# EAGLE design CNC-KeyboardBoard (EAGLE 6.3)
CNC Control Panel Keyboard Board 18 keys 16 LEDs
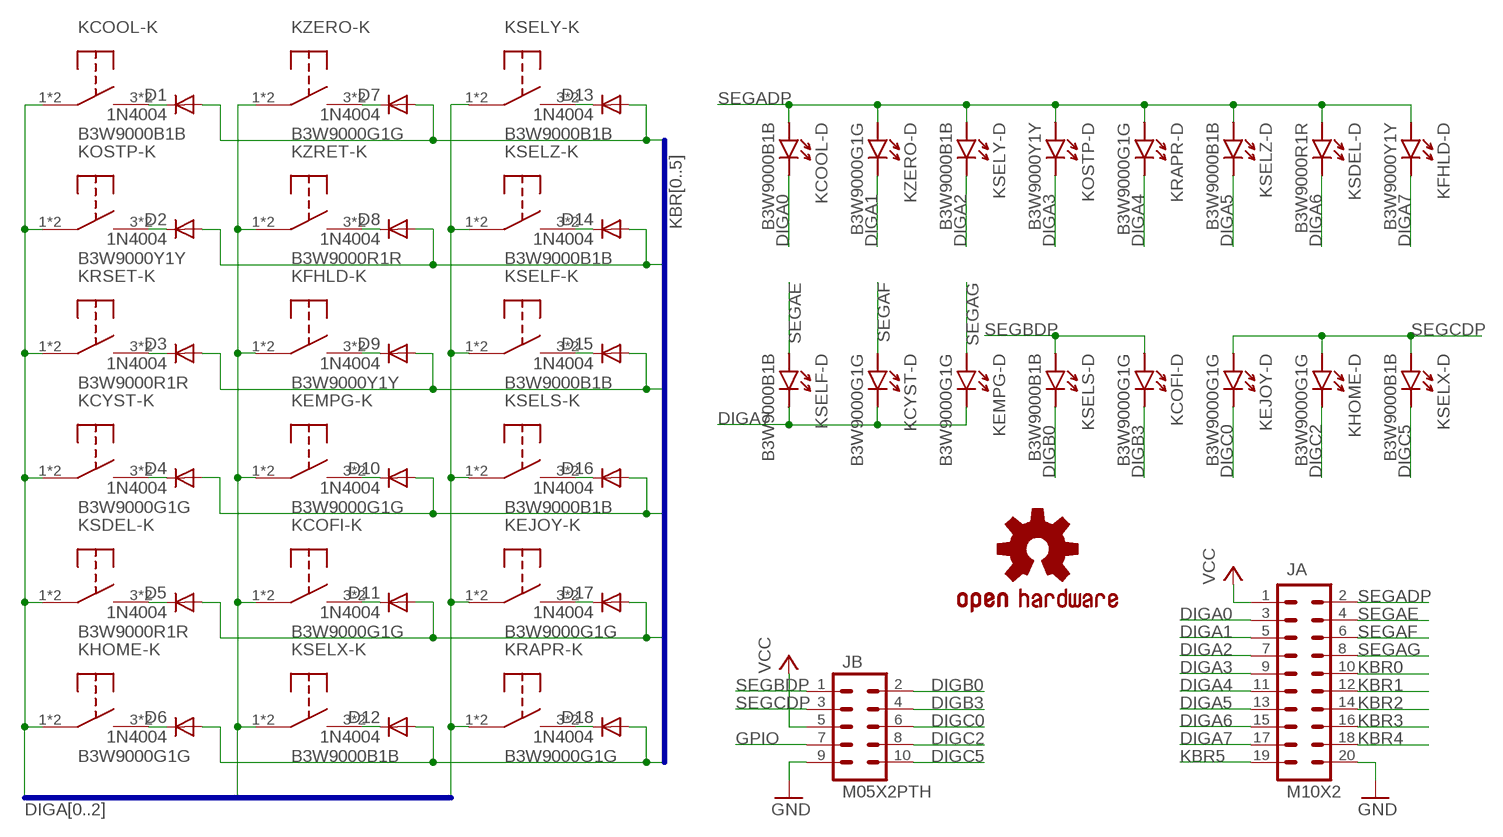
[diagram p0: schematic, sheet 1]

## Parts
D1  1N4004  [DO41-10]
D2  1N4004  [DO41-10]
D3  1N4004  [DO41-10]
D4  1N4004  [DO41-10]
D5  1N4004  [DO41-10]
D6  1N4004  [DO41-10]
D7  1N4004  [DO41-10]
D8  1N4004  [DO41-10]
D9  1N4004  [DO41-10]
D10  1N4004  [DO41-10]
D11  1N4004  [DO41-10]
D12  1N4004  [DO41-10]
D13  1N4004  [DO41-10]
D14  1N4004  [DO41-10]
D15  1N4004  [DO41-10]
D16  1N4004  [DO41-10]
D17  1N4004  [DO41-10]
D18  1N4004  [DO41-10]
JA  M10X2  [2X10]
JB  M05X2PTH  [AVR_ICSP]
KCOFI  B3W9000G1G  [OMRON_B3W90]
KCOOL  B3W9000B1B  [OMRON_B3W90]
KCYST  B3W9000G1G  [OMRON_B3W90]
KEJOY  B3W9000G1G  [OMRON_B3W90]
KEMPG  B3W9000G1G  [OMRON_B3W90]
KFHLD  B3W9000Y1Y  [OMRON_B3W90]
KHOME  B3W9000G1G  [OMRON_B3W90]
KOSTP  B3W9000Y1Y  [OMRON_B3W90]
KRAPR  B3W9000G1G  [OMRON_B3W90]
KRSET  B3W9000R1R  [OMRON_B3W90]
KSDEL  B3W9000R1R  [OMRON_B3W90]
KSELF  B3W9000B1B  [OMRON_B3W90]
KSELS  B3W9000B1B  [OMRON_B3W90]
KSELX  B3W9000B1B  [OMRON_B3W90]
KSELY  B3W9000B1B  [OMRON_B3W90]
KSELZ  B3W9000B1B  [OMRON_B3W90]
KZERO  B3W9000G1G  [OMRON_B3W90]
KZRET  B3W9000R1R  [OMRON_B3W90]
U$1  SPARKFUN_OSHW-LOGOL  [SPARKFUN_OSHW-LOGO-L]

## Nets
DIGA0: JA.3 KCOOL.1 KCOOL.2 KCOOL.6(-D:K) KCYST.1 KCYST.2 KHOME.1 KHOME.2 KOSTP.1 KOSTP.2 KRSET.1 KRSET.2 KSDEL.1 KSDEL.2
DIGA1: JA.5 KCOFI.1 KCOFI.2 KEMPG.1 KEMPG.2 KFHLD.1 KFHLD.2 KSELX.1 KSELX.2 KZERO.1 KZERO.2 KZERO.6(-D:K) KZRET.1 KZRET.2
DIGA2: JA.7 KEJOY.1 KEJOY.2 KRAPR.1 KRAPR.2 KSELF.1 KSELF.2 KSELS.1 KSELS.2 KSELY.1 KSELY.2 KSELY.6(-D:K) KSELZ.1 KSELZ.2
DIGA3: JA.9 KOSTP.6(-D:K)
DIGA4: JA.11 KRAPR.6(-D:K)
DIGA5: JA.13 KSELZ.6(-D:K)
DIGA6: JA.15 KSDEL.6(-D:K)
DIGA7: JA.17 KCYST.6(-D:K) KEMPG.6(-D:K) KFHLD.6(-D:K) KSELF.6(-D:K)
DIGB0: JB.2 KSELS.6(-D:K)
DIGB3: JB.4 KCOFI.6(-D:K)
DIGC0: JB.6 KEJOY.6(-D:K)
DIGC2: JB.8 KHOME.6(-D:K)
DIGC5: JB.10 KSELX.6(-D:K)
GND: JA.20 JB.9
GPIO: JB.7
KBR0: D1.A D7.A D13.A JA.10
KBR1: D2.A D8.A D14.A JA.12
KBR2: D3.A D9.A D15.A JA.14
KBR3: D4.A D10.A D16.A JA.16
KBR4: D5.A D11.A D17.A JA.18
KBR5: D6.A D12.A D18.A JA.19
N$58: D3.C KRSET.3 KRSET.4
N$59: D4.C KCYST.3 KCYST.4
N$60: D5.C KSDEL.3 KSDEL.4
N$61: D6.C KHOME.3 KHOME.4
N$62: D1.C KCOOL.3 KCOOL.4
N$63: D7.C KZERO.3 KZERO.4
N$64: D8.C KZRET.3 KZRET.4
N$65: D9.C KFHLD.3 KFHLD.4
N$67: D11.C KCOFI.3 KCOFI.4
N$68: D12.C KSELX.3 KSELX.4
N$69: D10.C KEMPG.3 KEMPG.4
N$70: D2.C KOSTP.3 KOSTP.4
N$71: D16.C KSELS.3 KSELS.4
N$72: D13.C KSELY.3 KSELY.4
N$73: D14.C KSELZ.3 KSELZ.4
N$74: D15.C KSELF.3 KSELF.4
N$76: D17.C KEJOY.3 KEJOY.4
N$77: D18.C KRAPR.3 KRAPR.4
SEGADP: JA.2 KCOOL.5(-D:A) KFHLD.5(-D:A) KOSTP.5(-D:A) KRAPR.5(-D:A) KSDEL.5(-D:A) KSELY.5(-D:A) KSELZ.5(-D:A) KZERO.5(-D:A)
SEGAE: JA.4 KSELF.5(-D:A)
SEGAF: JA.6 KCYST.5(-D:A)
SEGAG: JA.8 KEMPG.5(-D:A)
SEGBDP: JB.1 KCOFI.5(-D:A) KSELS.5(-D:A)
SEGCDP: JB.3 KEJOY.5(-D:A) KHOME.5(-D:A) KSELX.5(-D:A)
VCC: JA.1 JB.5
Unconnected: KRSET.5(-D:A) KRSET.6(-D:K) KZRET.5(-D:A) KZRET.6(-D:K)

## Buses
KBR[0..5]
DIGA[0..2]

## Library data of the parts
D1-D18 = diode:1N4004: DIODE general purpose rectifier, 1 A
JA = SparkFun-Connectors:M10X2: This was SPECIALLY designed to be used with our Graphic LCD Backpack. Be sure you want to use this! It is not only staggered on each line of header holes, but IT IS ALSO offset of the center point of the top and bottom lines by 5 mil. This causes the headers to lock into place on the "standard" footprint on the LCD screen. The extra squares on the tdocu layer are there simply to reference other pins (if you were to actually populate a longer header than ten long - this is what we do with the backpacks).
JB = SparkFun-Connectors:M05X2: Header 5x2 Standard 10-pin dual row 0.1" header. Commonly used with AVR-ISP. Use with Spark Fun Electronics SKU: PRT-00778
KCOFI KCOOL KCYST KEJOY KEMPG KFHLD KHOME KOSTP KRAPR KRSET KSDEL KSELF KSELS KSELX KSELY KSELZ KZERO KZRET = radu-collected:B3W90*: OMRON B3W-90 series illuminated pushbutton swtiches
U$1 = Si4735_Breakout-v10:SPARKFUN_OSHW-LOGO: Open Source Hardware Logo This logo indicates the piece of hardware it is found on incorporates a OSHW license and/or adheres to the definition of open source hardware found here: http://freedomdefined.org/OSHW

## Board
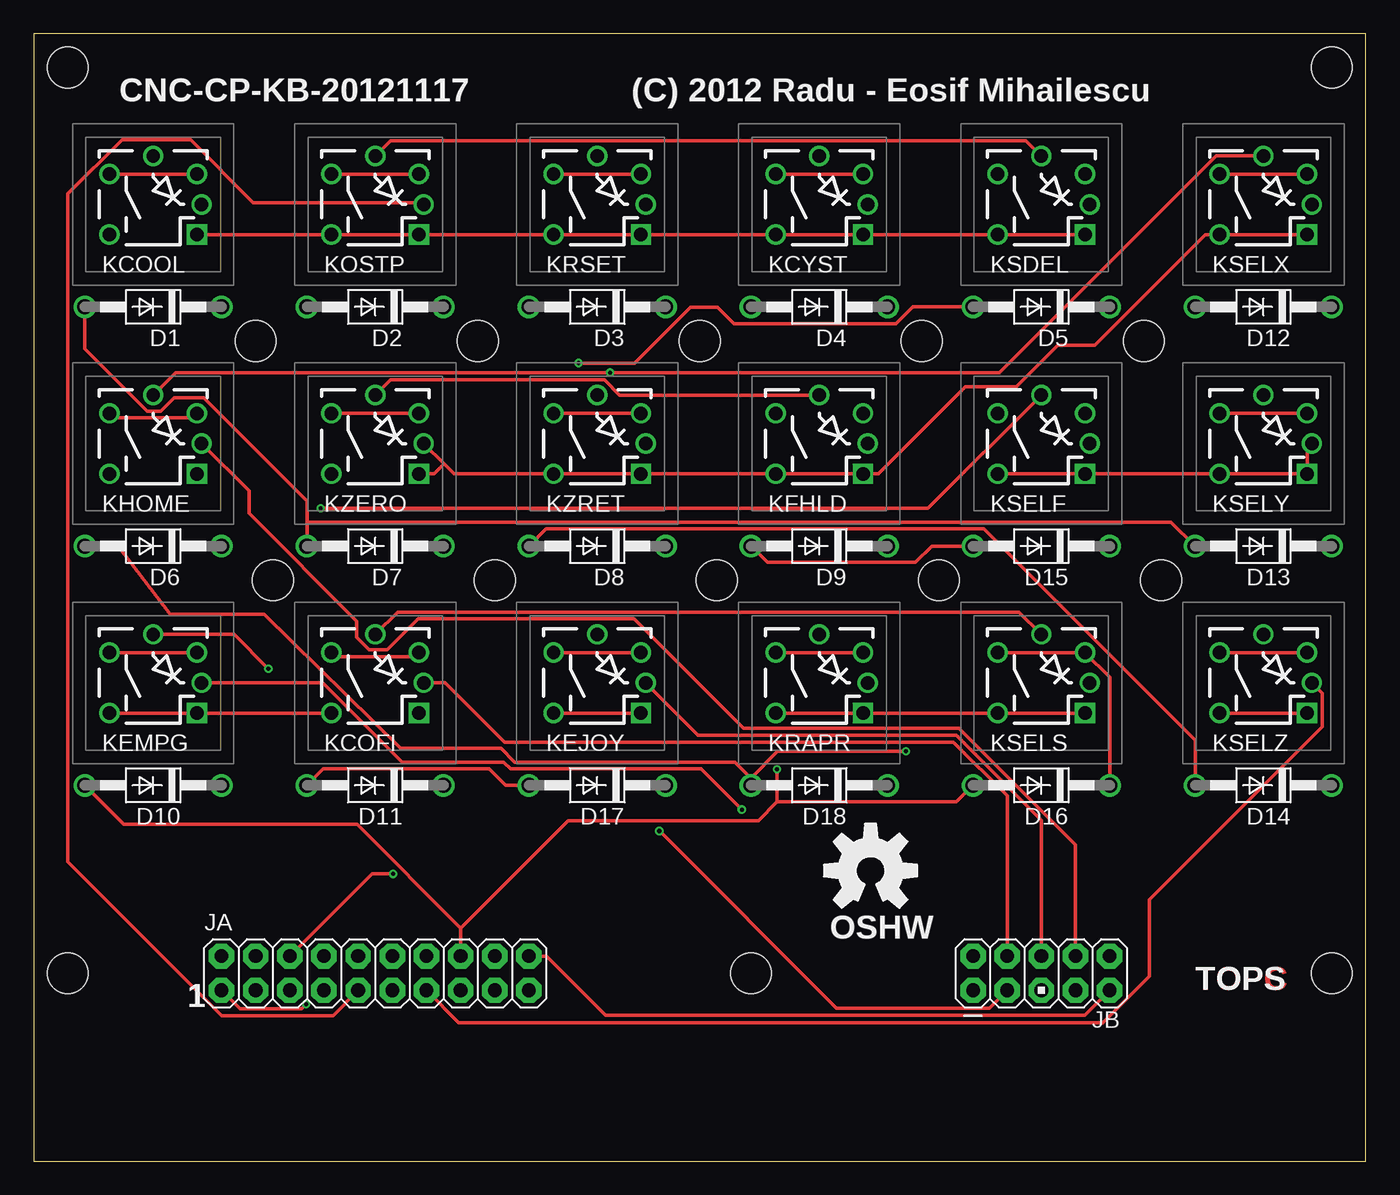
[diagram p1: board, top side]
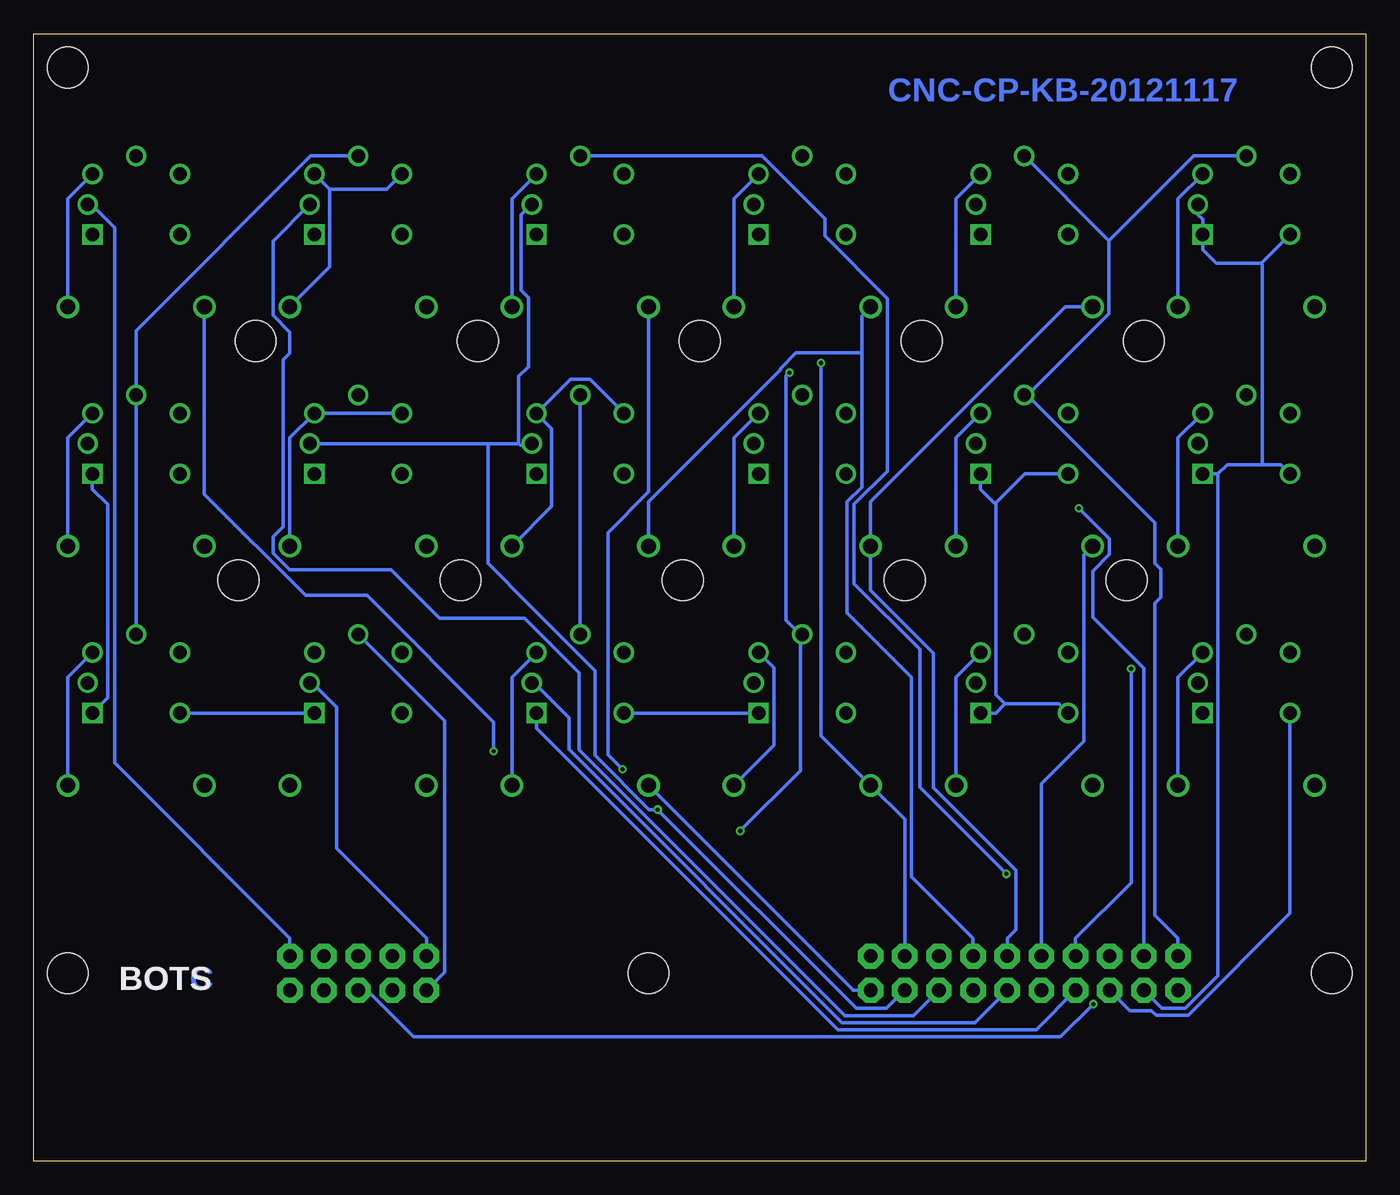
[diagram p2: board, bottom side, seen from below]

Size 99.06 x 83.81 mm. Coordinates in mm from the lower left corner, seen from the top.
Outline: 0,0 99.06,0 99.06,83.81 0,83.81 0,0
Copper layers (1*16): Top 0.035mm / dielectric 1.5mm / Bottom 0.035mm
Design rules "ITEADstudio_DRC": minimum track width 10mil, minimum drill 12mil, track to track 10mil, track to pad 10mil, pad to pad 10mil, via to via 10mil, smd to smd 0mil, copper to edge 20mil, drill to drill 10mil, minimum pad ring 10mil, minimum via ring 6mil, stop-mask expansion 4mil, vias tented up to drill 100mil, thermal gap 10mil
Holes 3.05 mm at 2.54,81.28 96.52,81.28 96.52,13.97 2.54,13.97 16.51,60.96 17.78,43.18 33.02,60.96 49.53,60.96 66.04,60.96 82.55,60.96 34.29,43.18 50.8,43.18 67.31,43.18 83.82,43.18 53.34,13.97

### Footprints (pad centres in the part's own frame; a part is rotated, then mirrored left to right if it is on the bottom)
DO41-10 = drill 1.118: A 5.08,0; C -5.08,0
2X10 = drill 1.016 pad 1.88 octagon: 1 -11.43,-1.27; 2 -11.43,1.27; 3 -8.89,-1.27; 4 -8.89,1.27; 5 -6.35,-1.27; 6 -6.35,1.27; 7 -3.81,-1.27; 8 -3.81,1.27; 9 -1.27,-1.27; 10 -1.27,1.27; 11 1.27,-1.27; 12 1.27,1.27; 13 3.81,-1.27; 14 3.81,1.27; 15 6.35,-1.27; 16 6.35,1.27; 17 8.89,-1.27; 18 8.89,1.27; 19 11.43,-1.27; 20 11.43,1.27
AVR_ICSP = drill 1.016 pad 1.88 octagon: 1 -1.27,5.08; 2 1.27,5.08; 3 -1.27,2.54; 4 1.27,2.54; 5 -1.27,0; 6 1.27,0; 7 -1.27,-2.54; 8 1.27,-2.54; 9 -1.27,-5.08; 10 1.27,-5.08
OMRON_B3W90 = drill 1 square: 1 3.25,-2.25 | drill 1: 2 -3.25,-2.25; 3 3.25,2.25; 4 -3.25,2.25; 5 0,3.6; 6 3.6,0

### Placement (x,y rotation side)
D1  8.89,63.5 180 top
D2  25.4,63.5 180 top
D3  41.91,63.5 180 top
D4  58.42,63.5 180 top
D5  74.93,63.5 180 top
D6  8.89,45.72 180 top
D7  25.4,45.72 180 top
D8  41.91,45.72 180 top
D9  58.42,45.72 180 top
D10  8.89,27.94 180 top
D11  25.4,27.94 180 top
D12  91.44,63.5 180 top
D13  91.44,45.72 180 top
D14  91.44,27.94 180 top
D15  74.93,45.72 180 top
D16  74.93,27.94 180 top
D17  41.91,27.94 180 top
D18  58.42,27.94 180 top
JA  25.4,13.97 0 top
JB  74.93,13.97 90 top
KCOFI  25.4,35.56 0 top
KCOOL  8.89,71.12 0 top
KCYST  58.42,71.12 0 top
KEJOY  41.91,35.56 0 top
KEMPG  8.89,35.56 0 top
KFHLD  58.42,53.34 0 top
KHOME  8.89,53.34 0 top
KOSTP  25.4,71.12 0 top
KRAPR  58.42,35.56 0 top
KRSET  41.91,71.12 0 top
KSDEL  74.93,71.12 0 top
KSELF  74.93,53.34 0 top
KSELS  74.93,35.56 0 top
KSELX  91.44,71.12 0 top
KSELY  91.44,53.34 0 top
KSELZ  91.44,35.56 0 top
KZERO  25.4,53.34 0 top
KZRET  41.91,53.34 0 top
U$1  62.23,21.59 0 top

### Tracks (layer width: path | path; a pad name or v marks a point on that pad's centre or on a via)
DIGA0
  Top 0.254: KCOOL.1 13.28,68.87 KOSTP.2 KOSTP.1 KRSET.2 KRSET.1 KCYST.2 KCYST.1 KSDEL.2 KSDEL.1
  Bottom 0.254: JA.3 15.19,11.38 13.42,11.38 11.01,13.8 11.01,51.09 | 7.7,51.77 10.32,51.77 11.01,51.09 | KHOME.2 6.32,51.77 7.7,51.77 | 7.78,66.73 7.7,66.65 7.7,51.77 | KHOME.1 11.01,51.09 | 7.78,66.73 KCOOL.2 | 7.78,66.73 11.13,66.73 12.14,67.73 KCOOL.1 12.14,69.44 12.14,70 12.49,70.36 KCOOL.6
DIGA1
  Top 0.254: 30.52,51.82 KZERO.6 | 30.52,51.82 31.25,51.09 KZRET.2 KZRET.1 KFHLD.2 60.53,51.09 KFHLD.1 62.8,51.09 69.29,57.57 73.08,57.57 76.16,60.66 78.92,60.66 87.13,68.87 KSELX.2 KSELX.1 | 30.52,51.82 29.79,51.09 KZERO.1 | KCOFI.2 13.28,33.31 KEMPG.1 KEMPG.2
  Bottom 0.254: KEMPG.2 5.64,18.44 13.22,10.86 15.6,10.86 15.94,11.2 17.55,11.2 JA.5 | 26.83,33.99 27.52,33.31 KCOFI.1 | KCOFI.2 22.83,33.99 26.83,33.99 | 27.52,48.95 27.52,34.68 26.83,33.99 | 27.52,48.95 25.37,51.09 KZERO.2 | 27.52,48.95 27.64,48.95 28.65,49.95 KZERO.1
DIGA2
  Top 0.254: KSELY.6 94.69,52.99 KSELY.1 KSELY.2 KSELF.1 KSELF.2 | KSELS.1 KSELS.2 62.8,33.31 KRAPR.1 KRAPR.2 | KEJOY.2 KEJOY.1 | KSELZ.2 KSELZ.1
  Bottom 0.254: KRAPR.1 61.67,32.17 39.27,9.78 24.52,9.78 JA.7 | KRAPR.2 KEJOY.1 | KSELY.1 94.69,49.95 93.56,48.82 93.56,34.45 KSELZ.1 | KSELZ.2 KSELS.1
DIGA3
  Top 0.254: KOSTP.6 28.89,71.23 | 28.89,71.23 | 28.89,71.23 16.34,71.23 11.66,75.91 6.57,75.91 2.55,71.89 2.55,22.25 13.98,10.82 22.25,10.82 JA.9
DIGA4
  Bottom 0.254: KRAPR.6 61.85,35.56 59.27,32.97 59.27,30.62 38.94,10.29 29.07,10.29 JA.11
DIGA5
  Top 0.254: KSELZ.6 95.83,34.77 95.83,32.31 82.95,19.44 82.95,13.76 79.5,10.31 31.6,10.31 JA.13
DIGA6
  Bottom 0.254: KSDEL.6 81.25,68.4 81.25,62.87 80.01,61.63 80.01,60.07 80.52,59.56 80.52,47.14 81.25,46.41 81.25,45.2 80.03,43.98 72.49,43.98 68.86,40.35 62.55,40.35 58.5,36.3 58.5,30.58 38.74,10.81 33.63,10.81 JA.15
DIGA7  (via drill 0.3 pad 0.61)
  Top 0.254: KEMPG.6 21.51,35.56 27.4,29.67 34.95,29.67 35.46,29.16 49.63,29.16 v52.66,26.14
  Bottom 0.254: 62.99,53.34 62.87,53.22 62.14,53.22 KFHLD.6 | KSELF.6 65.28,53.34 | 65.28,53.34 62.99,53.34 | 62.99,53.34 62.99,58.33 62.26,59.07 62.26,64.17 62.8,64.72 62.8,70.33 KCYST.6 | JA.17 35.63,11.36 37.88,11.36 v52.66,26.14 53.29,26.14 57.32,30.17 57.32,36.46 62.19,41.33 65.28,44.45 65.28,53.34
DIGB0
  Bottom 0.254: JB.2 69.85,16.56 76.53,23.24 76.53,33.75 78.34,35.56 KSELS.6
DIGB3
  Top 0.254: KCOFI.6 30.6,35.56 35.01,31.15 68.39,31.15 72.39,27.15 72.39,16.56 JB.4
DIGC0
  Top 0.254: KEJOY.6 49.4,31.67 68.61,31.67 74.93,25.34 JB.6
DIGC2
  Top 0.254: JB.8 77.47,23.52 68.82,32.17 52.78,32.17 44.66,40.3 28.58,40.3 26.28,38 24.95,38 24.02,38.93 24.02,40.15 16.01,48.16 16.01,49.82 KHOME.6
DIGC5
  Bottom 0.254: KSELX.6 94.77,71.12 93.05,69.4 93.05,29.6 80.01,16.56 JB.10
GND
  Top 0.254: JA.20 38.15,15.24 42.54,10.85 78.16,10.85 JB.9
KBR0
  Top 0.254: D13.A 84.58,47.51 20.32,47.51 | 20.32,47.51 20.32,49.07 12.64,56.75 10.46,56.75 9.46,55.75 8.46,55.75 3.81,60.4 D1.A | D7.A 20.32,47.51
  Bottom 0.254: JA.10 24.13,28.06 20.95,31.23 20.95,45.09 D7.A
KBR1
  Top 0.254: D8.A 38.11,47 70.64,47 86.36,31.28 D14.A
  Bottom 0.254: JA.12 26.67,16.56 26.04,17.2 26.04,21.64 32.16,27.76 32.16,37.77 36.83,42.44 D8.A 36.83,49.02 22.36,63.5 D2.A
KBR2
  Top 0.254: D9.A 54.56,44.5 65.58,44.5 66.8,45.72 D15.A
  Bottom 0.254: 37.48,60.08 37.48,50.1 38.57,49.01 38.57,40.77 33.78,35.98 33.78,21.13 29.21,16.56 JA.14 | D3.A 37.48,62.85 37.48,60.08 | D9.A 53.34,49.03 43.55,58.82 43.55,58.9 42.37,60.08 37.48,60.08
KBR3  (via drill 0.3 pad 0.61)
  Top 0.254: 55.27,26.71 v55.27,29.14 | 31.75,17.32 39.74,25.31 53.88,25.31 55.27,26.71 | D16.A 68.62,26.71 55.27,26.71 | 31.75,17.32 24.04,25.04 6.71,25.04 D10.A | JA.16 31.75,17.32
  Bottom 0.254: D4.A 53.34,49.74 56.36,46.72 56.36,30.22 v55.27,29.14
KBR4  (via drill 0.3 pad 0.61)
  Top 0.254: v40.51,59.33 44.69,59.33 48.84,63.48 50.85,63.48 52.08,62.25 64.12,62.25 65.37,63.5 D5.A | D17.A 35.09,27.94 33.87,29.16 21.54,29.16 D11.A
  Bottom 0.254: v40.51,59.33 40.51,31.62 D17.A 34.29,25.4 JA.18
KBR5  (via drill 0.3 pad 0.61)
  Top 0.254: 53.34,28.48 D18.A | D6.A 6.28,45.72 10.16,40.64 17.14,40.64 27.28,30.68 34.76,30.68 35.77,29.67 52.15,29.67 53.34,28.48 | 53.34,28.48 55.33,30.46 v64.85,30.46
  Bottom 0.254: v64.85,30.46 64.85,32.64 74.27,42.06 78.85,42.06 86.36,49.57 D12.A | JA.19 38.15,12.7 38.15,12.75 D18.A
N$58
  Top 0.254: KRSET.4 KRSET.3
  Bottom 0.254: KRSET.3 46.99,71.54 D3.C
N$59
  Top 0.254: KCYST.4 KCYST.3
  Bottom 0.254: KCYST.3 63.5,71.54 D4.C
N$60
  Bottom 0.254: 77.05,72.23 77.05,66.47 D5.C | KSDEL.3 77.05,72.23 | KSDEL.4 72.81,72.23 77.05,72.23
N$61
  Top 0.254: KHOME.4 5.99,55.24 11.79,55.24 KHOME.3
  Bottom 0.254: KHOME.3 13.97,53.76 D6.C
N$62
  Top 0.254: KCOOL.4 KCOOL.3
  Bottom 0.254: KCOOL.3 13.97,71.54 D1.C
N$63
  Top 0.254: KZERO.4 KZERO.3
  Bottom 0.254: KZERO.3 30.48,53.76 D7.C
N$64
  Top 0.254: KZRET.4 KZRET.3
  Bottom 0.254: KZRET.3 46.99,53.76 D8.C
N$65
  Bottom 0.254: KFHLD.4 57.69,58.11 59.15,58.11 KFHLD.3 60.53,54.45 60.53,48.69 D9.C
N$67
  Top 0.254: KCOFI.4 22.47,37.49 28.33,37.49 KCOFI.3
  Bottom 0.254: KCOFI.3 30.48,35.98 D11.C
N$68
  Top 0.254: KSELX.4 KSELX.3
  Bottom 0.254: KSELX.3 96.52,71.54 D12.C
N$69
  Top 0.254: KEMPG.4 KEMPG.3
  Bottom 0.254: KEMPG.3 13.97,35.98 D10.C
N$70
  Top 0.254: KOSTP.4 KOSTP.3
  Bottom 0.254: KOSTP.3 30.48,71.54 D2.C
N$71
  Top 0.254: KSELS.4 KSELS.3 80.01,35.98 D16.C
N$72
  Top 0.254: KSELY.4 KSELY.3
  Bottom 0.254: KSELY.3 96.52,53.76 D13.C
N$73
  Top 0.254: KSELZ.4 KSELZ.3
  Bottom 0.254: D14.C 96.52,35.98 KSELZ.3
N$74
  Bottom 0.254: KSELF.4 KSELF.3 80.01,53.76 D15.C
N$76
  Top 0.254: KEJOY.4 KEJOY.3
  Bottom 0.254: KEJOY.3 44.02,36.67 44.02,30.91 D17.C
N$77
  Top 0.254: KRAPR.4 KRAPR.3
  Bottom 0.254: KRAPR.3 63.5,35.98 D18.C
SEGADP
  Top 0.254: KZERO.5 26.54,58.08 42.43,58.08 43.57,56.94 KFHLD.5 | KOSTP.5 26.54,75.86 73.79,75.86 KSDEL.5
  Bottom 0.254: KSDEL.5 78.45,74.72 91.44,61.73 KSELY.5 KSELZ.5 | 25.15,56.94 19.09,63 19.09,68.42 | KZERO.5 25.15,56.94 | 25.15,56.94 15.69,47.47 15.68,44.45 15.24,44.01 15.24,41.91 15.68,41.47 15.69,18.28 13.97,16.56 JA.2 | 19.09,68.42 KOSTP.5 | KCOOL.5 12.79,74.72 19.09,68.42 | KRAPR.5 KFHLD.5
SEGAE  (via drill 0.3 pad 0.61)
  Top 0.254: KSELF.5 66.51,48.52 v21.34,48.52
  Bottom 0.254: v21.34,48.52 19.07,46.25 19.07,45.1 20.31,43.86 20.31,40.42 16.51,36.62 JA.4
SEGAF  (via drill 0.3 pad 0.61)
  Top 0.254: v26.72,21.35 25.16,21.35 JA.6
  Bottom 0.254: KCYST.5 44.9,74.72 40.23,70.05 40.23,68.79 35.56,64.12 35.56,51.3 38.05,48.81 38.05,42.94 33.15,38.04 33.15,27.78 v26.72,21.35
SEGAG  (via drill 0.3 pad 0.61)
  Top 0.254: KEMPG.5 14.9,39.16 v17.46,36.6
  Bottom 0.254: JA.8 21.59,16.56 17.46,20.7 v17.46,36.6
SEGBDP
  Top 0.254: KSELS.5 73.28,40.81 27.05,40.81 KCOFI.5
  Bottom 0.254: JB.1 68.52,14.03 68.52,32.75 KSELS.5
SEGCDP  (via drill 0.3 pad 0.61)
  Top 0.254: v46.52,24.55 59.69,11.38 71.06,11.38 JB.3 | KHOME.5 10.57,58.62 v42.86,58.62 71.82,58.62 87.92,74.72 KSELX.5
  Bottom 0.254: 42.06,39.16 42.06,29.01 v46.52,24.55 | v42.86,58.62 43.11,58.37 43.11,40.21 42.06,39.16 | 42.06,39.16 KEJOY.5
VCC  (via drill 0.3 pad 0.61)
  Top 0.254: v20.27,11.68 19.92,11.33 15.34,11.33 JA.1
  Bottom 0.254: JB.5 74.28,12.7 70.82,9.24 22.7,9.24 v20.27,11.68

### Text on the board
Top: TOPC
Bottom: CNC-CP-KB-20121117 | BOTC
tPlace: CNC-CP-KB-20121117 | (C) 2012 Radu - Eosif Mihailescu | OSHW | TOPS | 1
bPlace: BOTS